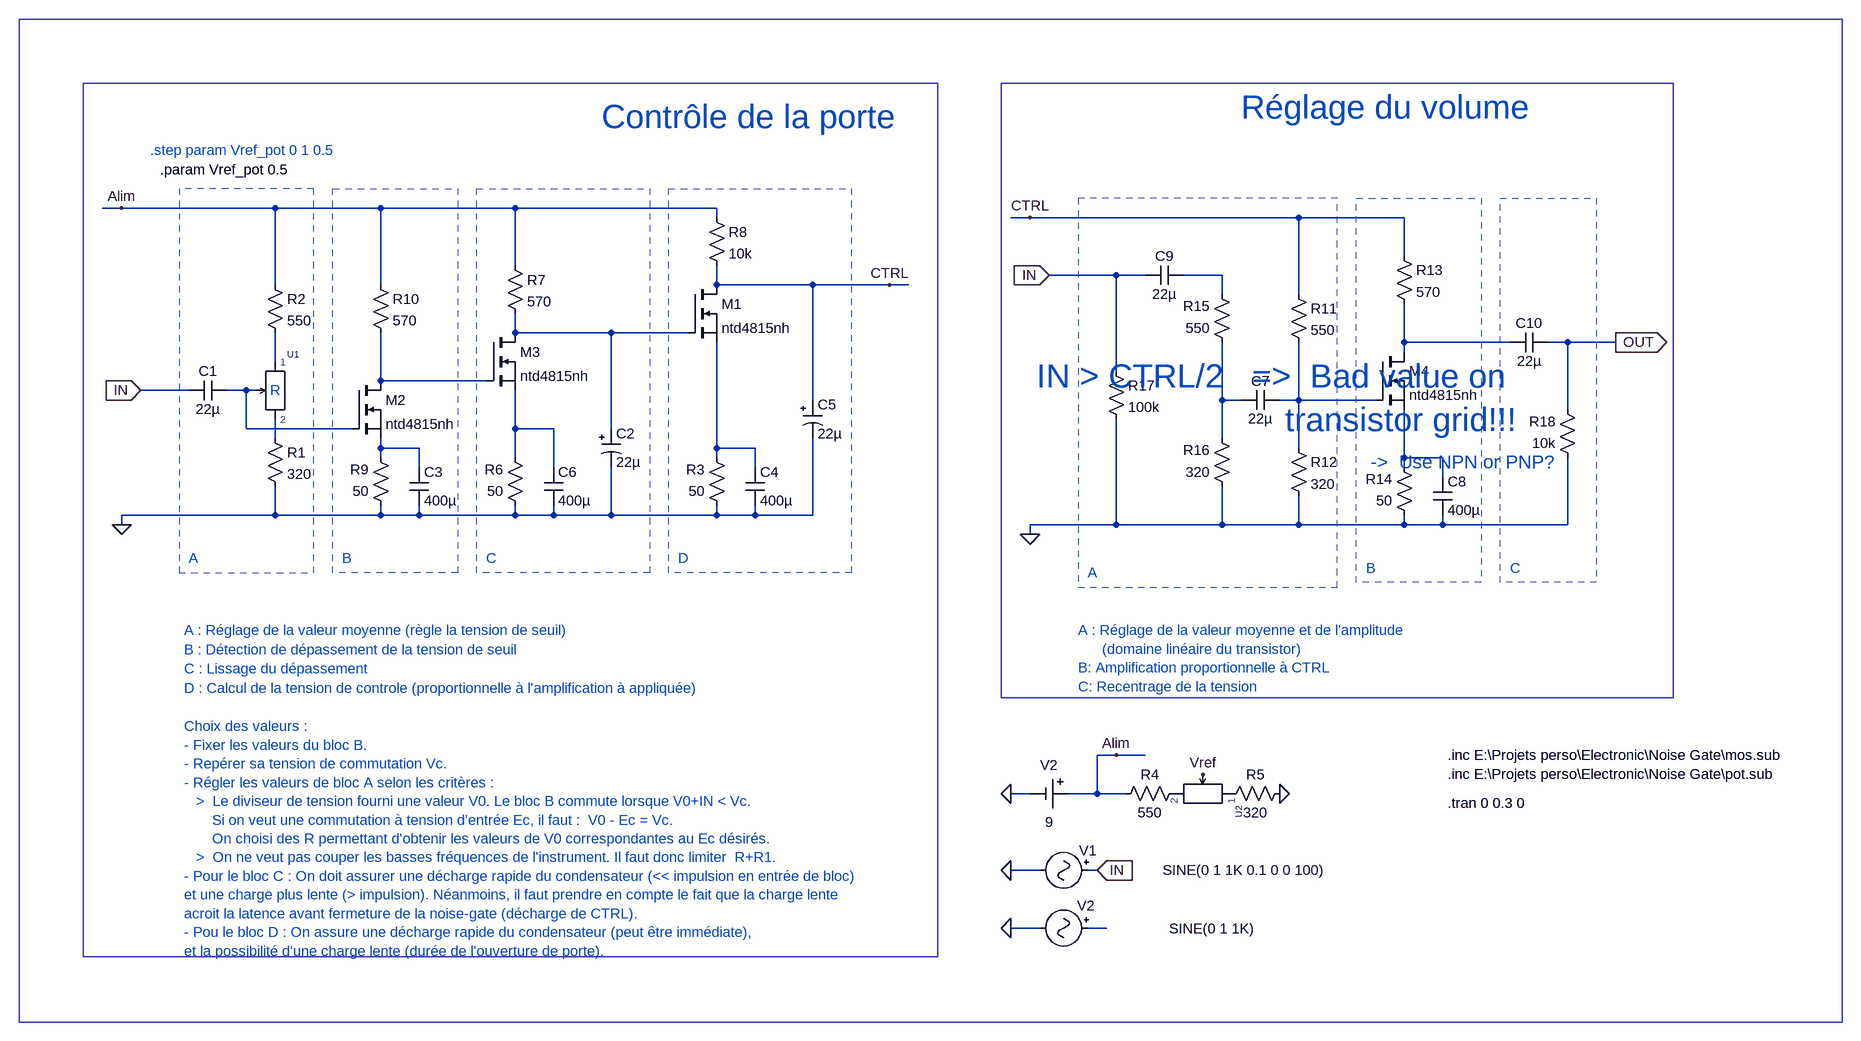
[diagram p0: schematic draft.asc]
draft.asc, the LTspice schematic file:
Version 4
SHEET 1 4852 2500
WIRE -800 16 -832 16
WIRE -544 16 -800 16
WIRE -368 16 -544 16
WIRE -144 16 -368 16
WIRE 192 16 -144 16
WIRE 192 32 192 16
WIRE 864 32 832 32
WIRE 1312 32 864 32
WIRE 1488 32 1312 32
WIRE 1488 96 1488 32
WIRE -144 112 -144 16
WIRE 1008 128 896 128
WIRE 1056 128 1008 128
WIRE 1184 128 1120 128
WIRE -544 144 -544 16
WIRE -368 144 -368 16
WIRE 192 144 192 112
WIRE 352 144 192 144
WIRE 480 144 352 144
WIRE 512 144 480 144
WIRE 1184 160 1184 128
WIRE 1312 160 1312 32
WIRE -144 224 -144 192
WIRE 16 224 -144 224
WIRE 144 224 16 224
WIRE 1488 240 1488 176
WIRE 1664 240 1488 240
WIRE 1760 240 1728 240
WIRE 1840 240 1760 240
WIRE 1488 256 1488 240
WIRE -544 272 -544 224
WIRE 1008 288 1008 128
WIRE -368 304 -368 224
WIRE -192 304 -368 304
WIRE -688 320 -768 320
WIRE -592 320 -624 320
WIRE -576 320 -592 320
WIRE 352 336 352 144
WIRE 1184 336 1184 240
WIRE 1216 336 1184 336
WIRE 1312 336 1312 240
WIRE 1312 336 1280 336
WIRE 1440 336 1312 336
WIRE 1760 352 1760 240
WIRE -592 384 -592 320
WIRE -416 384 -592 384
WIRE -144 384 -144 320
WIRE -80 384 -144 384
WIRE 16 384 16 224
WIRE -544 400 -544 368
WIRE 1184 400 1184 336
WIRE -368 416 -368 400
WIRE -304 416 -368 416
WIRE 192 416 192 240
WIRE 256 416 192 416
WIRE 1312 416 1312 336
WIRE -368 432 -368 416
WIRE -144 432 -144 384
WIRE 192 432 192 416
WIRE 1488 432 1488 352
WIRE 1552 432 1488 432
WIRE -304 448 -304 416
WIRE -80 448 -80 384
WIRE 256 448 256 416
WIRE 1488 448 1488 432
WIRE 1552 464 1552 432
WIRE -544 528 -544 480
WIRE -544 528 -800 528
WIRE -368 528 -368 512
WIRE -368 528 -544 528
WIRE -304 528 -304 512
WIRE -304 528 -368 528
WIRE -144 528 -144 512
WIRE -144 528 -304 528
WIRE -80 528 -80 512
WIRE -80 528 -144 528
WIRE 16 528 16 448
WIRE 16 528 -80 528
WIRE 192 528 192 512
WIRE 192 528 16 528
WIRE 256 528 256 512
WIRE 256 528 192 528
WIRE 352 528 352 400
WIRE 352 528 256 528
WIRE -800 544 -800 528
WIRE 1008 544 1008 368
WIRE 1008 544 864 544
WIRE 1184 544 1184 480
WIRE 1184 544 1008 544
WIRE 1312 544 1312 496
WIRE 1312 544 1184 544
WIRE 1488 544 1488 528
WIRE 1488 544 1312 544
WIRE 1552 544 1552 528
WIRE 1552 544 1488 544
WIRE 1760 544 1760 432
WIRE 1760 544 1552 544
WIRE 864 560 864 544
WIRE 1008 928 976 928
WIRE 1056 928 1008 928
WIRE 864 992 832 992
WIRE 976 992 976 928
WIRE 976 992 928 992
WIRE 1024 992 976 992
WIRE 880 1120 832 1120
WIRE 976 1120 960 1120
WIRE 880 1216 832 1216
WIRE 992 1216 960 1216
FLAG 832 1120 0
FLAG 832 992 0
FLAG 1008 928 Alim
FLAG -768 320 IN
IOPIN -768 320 In
FLAG -800 16 Alim
FLAG -800 544 0
FLAG 832 1216 0
FLAG 1280 992 0
FLAG 1152 960 Vref
FLAG 976 1120 IN
IOPIN 976 1120 In
FLAG 480 144 CTRL
FLAG 896 128 IN
IOPIN 896 128 In
FLAG 864 32 CTRL
FLAG 864 560 0
FLAG 1840 240 OUT
IOPIN 1840 240 Out
SYMBOL Misc\\signal 976 1120 R90
WINDOW 123 0 0 Left 2
WINDOW 39 0 0 Left 2
WINDOW 0 -33 1 VRight 2
WINDOW 3 0 -379 VRight 2
SYMATTR InstName V1
SYMATTR Value SINE(0 1 1K 0.1 0 0 100)
SYMBOL Misc\\cell 928 992 R90
WINDOW 0 -32 32 VBottom 2
WINDOW 3 32 32 VTop 2
SYMATTR InstName V2
SYMATTR Value 9
SYMBOL cap -688 336 R270
WINDOW 0 32 32 VTop 2
WINDOW 3 0 32 VBottom 2
SYMATTR InstName C1
SYMATTR Value 22µ
SYMBOL pot2 -544 320 R0
SYMATTR InstName U1
SYMATTR SpiceLine Rtot=80 wiper={Vref_pot}
SYMBOL res -560 128 R0
SYMATTR InstName R2
SYMATTR Value 550
SYMBOL res -560 384 R0
SYMATTR InstName R1
SYMATTR Value 320
SYMBOL nmos -416 304 R0
SYMATTR InstName M2
SYMATTR Value ntd4815nh
SYMATTR Prefix X
SYMBOL res -384 128 R0
SYMATTR InstName R10
SYMATTR Value 570
SYMBOL res -352 528 R180
WINDOW 0 36 76 Left 2
WINDOW 3 36 40 Left 2
SYMATTR InstName R9
SYMATTR Value 50
SYMBOL cap -320 448 R0
SYMATTR InstName C3
SYMATTR Value 400µ
SYMBOL polcap 0 384 R0
SYMATTR InstName C2
SYMATTR Value 22µ
SYMBOL nmos 144 144 R0
SYMATTR InstName M1
SYMATTR Value ntd4815nh
SYMATTR Prefix X
SYMBOL res 176 16 R0
SYMATTR InstName R8
SYMATTR Value 10k
SYMBOL res 208 528 R180
WINDOW 0 36 76 Left 2
WINDOW 3 36 40 Left 2
SYMATTR InstName R3
SYMATTR Value 50
SYMBOL cap 240 448 R0
SYMATTR InstName C4
SYMATTR Value 400µ
SYMBOL polcap 336 336 R0
SYMATTR InstName C5
SYMATTR Value 22µ
SYMBOL Misc\\signal 976 1216 R90
WINDOW 123 0 0 Left 2
WINDOW 39 0 0 Left 2
WINDOW 0 -37 4 VRight 2
WINDOW 3 1 -262 VRight 2
SYMATTR InstName V2
SYMBOL pot2 1152 992 R90
SYMATTR InstName U2
SYMATTR SpiceLine Rtot=5k wiper={Vref_pot}
SYMBOL res 1008 1008 R270
WINDOW 0 32 56 VTop 2
WINDOW 3 0 56 VBottom 2
SYMATTR InstName R4
SYMATTR Value 550
SYMBOL res 1184 1008 R270
WINDOW 0 32 56 VTop 2
WINDOW 3 0 56 VBottom 2
SYMATTR InstName R5
SYMATTR Value 320
SYMBOL nmos -192 224 R0
SYMATTR InstName M3
SYMATTR Value ntd4815nh
SYMATTR Prefix X
SYMBOL res -128 528 R180
WINDOW 0 36 76 Left 2
WINDOW 3 36 40 Left 2
SYMATTR InstName R6
SYMATTR Value 50
SYMBOL res -160 96 R0
SYMATTR InstName R7
SYMATTR Value 570
SYMBOL cap -96 448 R0
SYMATTR InstName C6
SYMATTR Value 400µ
SYMBOL cap 1216 352 R270
WINDOW 0 32 32 VTop 2
WINDOW 3 0 32 VBottom 2
SYMATTR InstName C7
SYMATTR Value 22µ
SYMBOL res 1296 144 R0
SYMATTR InstName R11
SYMATTR Value 550
SYMBOL res 1296 400 R0
SYMATTR InstName R12
SYMATTR Value 320
SYMBOL nmos 1440 256 R0
SYMATTR InstName M4
SYMATTR Value ntd4815nh
SYMATTR Prefix X
SYMBOL res 1472 80 R0
SYMATTR InstName R13
SYMATTR Value 570
SYMBOL res 1504 544 R180
WINDOW 0 36 76 Left 2
WINDOW 3 36 40 Left 2
SYMATTR InstName R14
SYMATTR Value 50
SYMBOL cap 1536 464 R0
SYMATTR InstName C8
SYMATTR Value 400µ
SYMBOL res 1200 256 R180
WINDOW 0 36 76 Left 2
WINDOW 3 36 40 Left 2
SYMATTR InstName R15
SYMATTR Value 550
SYMBOL res 1200 496 R180
WINDOW 0 36 76 Left 2
WINDOW 3 36 40 Left 2
SYMATTR InstName R16
SYMATTR Value 320
SYMBOL cap 1056 144 R270
WINDOW 0 32 32 VTop 2
WINDOW 3 0 32 VBottom 2
SYMATTR InstName C9
SYMATTR Value 22µ
SYMBOL res 992 272 R0
SYMATTR InstName R17
SYMATTR Value 100k
SYMBOL cap 1664 256 R270
WINDOW 0 32 32 VTop 2
WINDOW 3 0 32 VBottom 2
SYMATTR InstName C10
SYMATTR Value 22µ
SYMBOL res 1776 448 R180
WINDOW 0 36 76 Left 2
WINDOW 3 36 40 Left 2
SYMATTR InstName R18
SYMATTR Value 10k
TEXT 1560 928 Left 2 !.inc E:\\Projets perso\\Electronic\\Noise Gate\\mos.sub
TEXT 1560 1008 Left 2 !.tran 0 0.3 0
TEXT 1560 960 Left 2 !.inc E:\\Projets perso\\Electronic\\Noise Gate\\pot.sub
TEXT -752 -80 Left 2 ;.step param Vref_pot 0 1 0.5
TEXT -736 -48 Left 2 !.param Vref_pot 0.5
TEXT -688 600 Left 2 ;A
TEXT -696 720 Left 2 ;A : Réglage de la valeur moyenne (règle la tension de seuil)
TEXT -432 600 Left 2 ;B
TEXT -192 600 Left 2 ;C
TEXT 128 600 Left 2 ;D
TEXT -696 752 Left 2 ;B : Détection de dépassement de la tension de seuil
TEXT -696 784 Left 2 ;C : Lissage du dépassement
TEXT -696 816 Left 2 ;D : Calcul de la tension de controle (proportionnelle à l'amplification à appliquée)
TEXT -696 880 Left 2 ;Choix des valeurs : \n- Fixer les valeurs du bloc B. \n- Repérer sa tension de commutation Vc.\n- Régler les valeurs de bloc A selon les critères :\n   >  Le diviseur de tension fourni une valeur V0. Le bloc B commute lorsque V0+IN < Vc.\n       Si on veut une commutation à tension d'entrée Ec, il faut :  V0 - Ec = Vc.\n       On choisi des R permettant d'obtenir les valeurs de V0 correspondantes au Ec désirés.\n   >  On ne veut pas couper les basses fréquences de l'instrument. Il faut donc limiter  R+R1.\n- Pour le bloc C : On doit assurer une décharge rapide du condensateur (<< impulsion en entrée de bloc)\net une charge plus lente (> impulsion). Néanmoins, il faut prendre en compte le fait que la charge lente\nacroit la latence avant fermeture de la noise-gate (décharge de CTRL).\n- Pou le bloc D : On assure une décharge rapide du condensateur (peut être immédiate), \net la possibilité d'une charge lente (durée de l'ouverture de porte).
TEXT -552 320 Left 2 ;R
TEXT 0 -136 Left 5 ;Contrôle de la porte
TEXT 960 624 Left 2 ;A
TEXT 1424 616 Left 2 ;B
TEXT 944 720 Left 2 ;A : Réglage de la valeur moyenne et de l'amplitude \n      (domaine linéaire du transistor)\nB: Amplification proportionnelle à CTRL\nC: Recentrage de la tension
TEXT 1216 -152 Left 5 ;Réglage du volume
TEXT 1664 616 Left 2 ;C
TEXT 1680 296 Right 5 ;IN > CTRL/2   =>  Bad value on \ntransistor grid!!!
TEXT 1432 440 Left 3 ;->  Use NPN or PNP?
RECTANGLE Normal -480 -16 -704 624 2
RECTANGLE Normal -240 624 -448 -16 2
RECTANGLE Normal 80 624 -208 -16 2
RECTANGLE Normal 416 624 112 -16 2
RECTANGLE Normal 560 1264 -864 -192
RECTANGLE Normal 1376 0 944 648 2
RECTANGLE Normal 1616 640 1408 0 2
RECTANGLE Normal 1936 832 816 -192
RECTANGLE Normal 1808 640 1648 0 2
RECTANGLE Normal 2256 1488 -1104 -432

The netlist it stands for:
* draft.asc
V1 IN 0 SINE(0 1 1K 0.1 0 0 100)
V2 Alim 0 9
C1 IN N006 22µ
XU1 N004 N010 N006 pot_lin Rtot=80 wiper={Vref_pot}  ; pins 1 2 ?
R2 Alim N004 550
R1 N010 0 320
XM2 N005 N006 N011 ntd4815nh  ; pins D G S
R10 Alim N005 570
R9 0 N011 50
C3 N011 0 400µ
C2 N002 0 22µ
XM1 CTRL N002 N012 ntd4815nh  ; pins D G S
R8 Alim CTRL 10k
R3 0 N012 50
C4 N012 0 400µ
C5 CTRL 0 22µ
V2 N014 0 SINE(0 1 1K)
XU2 P001 P002 Vref pot_lin Rtot=5k wiper={Vref_pot}  ; pins 1 2 ?
R4 Alim P002 550
R5 P001 0 320
XM3 N002 N005 N009 ntd4815nh  ; pins D G S
R6 0 N009 50
R7 Alim N002 570
C6 N009 0 400µ
C7 N007 N008 22µ
R11 CTRL N008 550
R12 N008 0 320
XM4 N003 N008 N013 ntd4815nh  ; pins D G S
R13 CTRL N003 570
R14 0 N013 50
C8 N013 0 400µ
R15 N007 N001 550
R16 0 N007 320
C9 IN N001 22µ
R17 IN 0 100k
C10 N003 OUT 22µ
R18 0 OUT 10k
.inc E:\Projets perso\Electronic\Noise Gate\mos.sub
.tran 0 0.3 0
.inc E:\Projets perso\Electronic\Noise Gate\pot.sub
* .step param Vref_pot 0 1 0.5
.param Vref_pot 0.5
* A
* A : Réglage de la valeur moyenne (règle la tension de seuil)
* B
* C
* D
* B : Détection de dépassement de la tension de seuil
* C : Lissage du dépassement
* D : Calcul de la tension de controle (proportionnelle à l'amplification à appliquée)
* Choix des valeurs :
* - Fixer les valeurs du bloc B.
* - Repérer sa tension de commutation Vc.
* - Régler les valeurs de bloc A selon les critères :
*    >  Le diviseur de tension fourni une valeur V0. Le bloc B commute lorsque V0+IN < Vc.
*        Si on veut une commutation à tension d'entrée Ec, il faut :  V0 - Ec = Vc.
*        On choisi des R permettant d'obtenir les valeurs de V0 correspondantes au Ec désirés.
*    >  On ne veut pas couper les basses fréquences de l'instrument. Il faut donc limiter  R+R1.
* - Pour le bloc C : On doit assurer une décharge rapide du condensateur (<< impulsion en entrée de bloc)
* et une charge plus lente (> impulsion). Néanmoins, il faut prendre en compte le fait que la charge lente
* acroit la latence avant fermeture de la noise-gate (décharge de CTRL).
* - Pou le bloc D : On assure une décharge rapide du condensateur (peut être immédiate),
* et la possibilité d'une charge lente (durée de l'ouverture de porte).
* R
* Contrôle de la porte
* A
* B
* A : Réglage de la valeur moyenne et de l'amplitude
*       (domaine linéaire du transistor)
* B: Amplification proportionnelle à CTRL
* C: Recentrage de la tension
* Réglage du volume
* C
* IN > CTRL/2   =>  Bad value on
* transistor grid!!!
* ->  Use NPN or PNP?
.lib E:\Projets perso\Electronic\Noise Gate\pot.sub
.backanno
.end